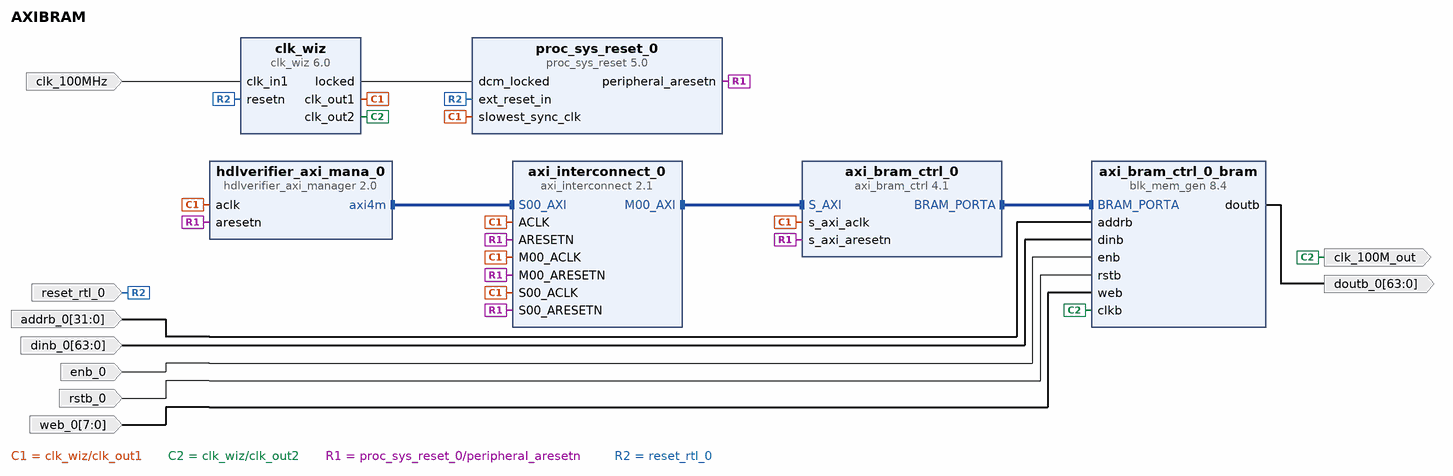
[diagram p0: block diagram of the top level]
# Vivado block design AXIBRAM, xcku5p-ffvb676-2-e, Vivado 2022.1
create_bd_design AXIBRAM

create_bd_port -dir I -type rst reset_rtl_0
set_property -dict {CONFIG.POLARITY ACTIVE_LOW} [get_bd_ports reset_rtl_0]
create_bd_port -dir I -type clk clk_100MHz
set_property -dict {CONFIG.FREQ_HZ 100000000} [get_bd_ports clk_100MHz]
create_bd_port -dir I -from 31 -to 0 addrb_0
create_bd_port -dir I -from 63 -to 0 dinb_0
create_bd_port -dir O -from 63 -to 0 doutb_0
create_bd_port -dir I -from 7 -to 0 web_0
create_bd_port -dir O -type clk clk_100M_out
create_bd_port -dir I enb_0
create_bd_port -dir I -type rst rstb_0

create_bd_cell -type ip -vlnv mathworks.com:ip:hdlverifier_axi_manager:2.0 hdlverifier_axi_mana_0
set_property -dict {CONFIG.AXI_DATA_WIDTH 64} [get_bd_cells hdlverifier_axi_mana_0]
create_bd_cell -type ip -vlnv xilinx.com:ip:axi_bram_ctrl:4.1 axi_bram_ctrl_0
set_property -dict {CONFIG.DATA_WIDTH 64 CONFIG.SINGLE_PORT_BRAM 1} [get_bd_cells axi_bram_ctrl_0]
create_bd_cell -type ip -vlnv xilinx.com:ip:blk_mem_gen:8.4 axi_bram_ctrl_0_bram
set_property -dict [list \
  CONFIG.Assume_Synchronous_Clk true \
  CONFIG.Enable_B Use_ENB_Pin \
  CONFIG.Memory_Type True_Dual_Port_RAM \
  CONFIG.Port_B_Clock 100 \
  CONFIG.Port_B_Enable_Rate 100 \
  CONFIG.Port_B_Write_Rate 50 \
  CONFIG.Use_RSTB_Pin true \
] [get_bd_cells axi_bram_ctrl_0_bram]
create_bd_cell -type ip -vlnv xilinx.com:ip:axi_interconnect:2.1 axi_interconnect_0
set_property -dict {CONFIG.NUM_MI 1} [get_bd_cells axi_interconnect_0]
create_bd_cell -type ip -vlnv xilinx.com:ip:clk_wiz:6.0 clk_wiz
set_property -dict [list \
  CONFIG.CLKOUT1_DRIVES BUFG \
  CONFIG.CLKOUT1_JITTER 130.958 \
  CONFIG.CLKOUT1_PHASE_ERROR 98.575 \
  CONFIG.CLKOUT2_DRIVES BUFG \
  CONFIG.CLKOUT2_JITTER 130.958 \
  CONFIG.CLKOUT2_PHASE_ERROR 98.575 \
  CONFIG.CLKOUT2_USED true \
  CONFIG.CLKOUT3_DRIVES Buffer \
  CONFIG.CLKOUT4_DRIVES Buffer \
  CONFIG.CLKOUT5_DRIVES Buffer \
  CONFIG.CLKOUT6_DRIVES Buffer \
  CONFIG.CLKOUT7_DRIVES Buffer \
  CONFIG.MMCM_CLKFBOUT_MULT_F 12.000 \
  CONFIG.MMCM_CLKOUT0_DIVIDE_F 12.000 \
  CONFIG.MMCM_CLKOUT1_DIVIDE 12 \
  CONFIG.MMCM_COMPENSATION AUTO \
  CONFIG.NUM_OUT_CLKS 2 \
  CONFIG.PHASESHIFT_MODE WAVEFORM \
  CONFIG.RESET_PORT resetn \
  CONFIG.RESET_TYPE ACTIVE_LOW \
  CONFIG.USE_PHASE_ALIGNMENT true \
] [get_bd_cells clk_wiz]
create_bd_cell -type ip -vlnv xilinx.com:ip:proc_sys_reset:5.0 proc_sys_reset_0

# ---- connections ----

connect_bd_intf_net [get_bd_intf_pins axi_bram_ctrl_0_bram/BRAM_PORTA] [get_bd_intf_pins axi_bram_ctrl_0/BRAM_PORTA]
connect_bd_intf_net [get_bd_intf_pins axi_interconnect_0/M00_AXI] [get_bd_intf_pins axi_bram_ctrl_0/S_AXI]
connect_bd_intf_net [get_bd_intf_pins hdlverifier_axi_mana_0/axi4m] [get_bd_intf_pins axi_interconnect_0/S00_AXI]
connect_bd_net -net addrb_0_1 [get_bd_ports addrb_0] [get_bd_pins axi_bram_ctrl_0_bram/addrb]
connect_bd_net [get_bd_pins axi_bram_ctrl_0_bram/doutb] [get_bd_ports doutb_0]
connect_bd_net [get_bd_ports clk_100MHz] [get_bd_pins clk_wiz/clk_in1]
connect_bd_net [get_bd_pins clk_wiz/clk_out1] \
  [get_bd_pins hdlverifier_axi_mana_0/aclk] [get_bd_pins axi_bram_ctrl_0/s_axi_aclk] [get_bd_pins axi_interconnect_0/ACLK] \
  [get_bd_pins axi_interconnect_0/S00_ACLK] [get_bd_pins axi_interconnect_0/M00_ACLK] \
  [get_bd_pins proc_sys_reset_0/slowest_sync_clk]
connect_bd_net [get_bd_pins clk_wiz/clk_out2] [get_bd_ports clk_100M_out] [get_bd_pins axi_bram_ctrl_0_bram/clkb]
connect_bd_net [get_bd_pins clk_wiz/locked] [get_bd_pins proc_sys_reset_0/dcm_locked]
connect_bd_net -net dinb_0_1 [get_bd_ports dinb_0] [get_bd_pins axi_bram_ctrl_0_bram/dinb]
connect_bd_net -net enb_0_1 [get_bd_ports enb_0] [get_bd_pins axi_bram_ctrl_0_bram/enb]
connect_bd_net [get_bd_pins proc_sys_reset_0/peripheral_aresetn] \
  [get_bd_pins hdlverifier_axi_mana_0/aresetn] [get_bd_pins axi_bram_ctrl_0/s_axi_aresetn] \
  [get_bd_pins axi_interconnect_0/ARESETN] [get_bd_pins axi_interconnect_0/S00_ARESETN] \
  [get_bd_pins axi_interconnect_0/M00_ARESETN]
connect_bd_net -net reset_rtl_0_1 [get_bd_ports reset_rtl_0] [get_bd_pins clk_wiz/resetn] [get_bd_pins proc_sys_reset_0/ext_reset_in]
connect_bd_net -net rstb_0_1 [get_bd_ports rstb_0] [get_bd_pins axi_bram_ctrl_0_bram/rstb]
connect_bd_net -net web_0_1 [get_bd_ports web_0] [get_bd_pins axi_bram_ctrl_0_bram/web]

# ---- address map ----
assign_bd_address -offset 0xC0000000 -range 8K -target_address_space [get_bd_addr_spaces hdlverifier_axi_mana_0/axi4m] [get_bd_addr_segs axi_bram_ctrl_0/S_AXI/Mem0]

validate_bd_design
save_bd_design
